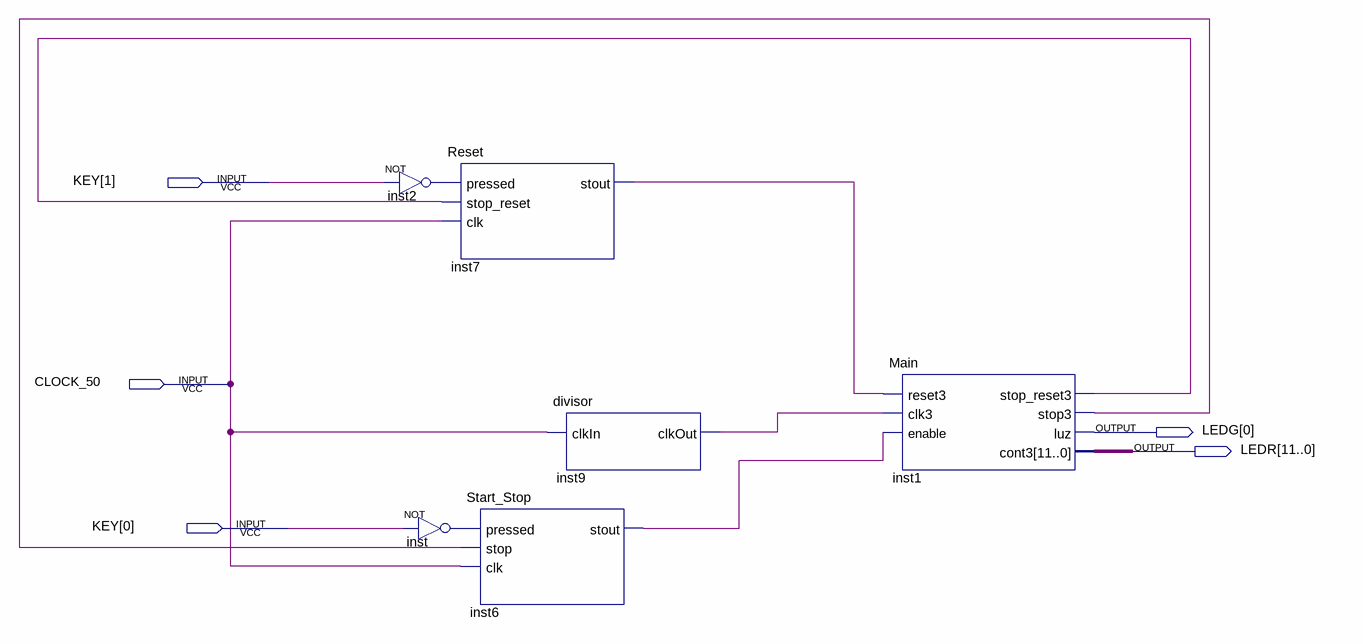
[diagram p0: schematic sheet]
// Quartus schematic Blocks.bdf as structural Verilog: 6 symbols, 5 pins
module Blocks (
  input  [1:0] KEY,
  input  CLOCK_50,
  output [0:0] LEDG,
  output [11:0] LEDR
);

  wire inst1_stop3, inst1_stop_reset3, inst2_out, inst6_stout, inst7_stout, inst9_clkout, inst_out;

  Reset inst7 (.pressed(inst2_out), .stop_reset(inst1_stop_reset3), .clk(CLOCK_50), .stout(inst7_stout));
  not inst2 (inst2_out, KEY[1]);
  not inst (inst_out, KEY[0]);
  Start_Stop inst6 (.pressed(inst_out), .stop(inst1_stop3), .clk(CLOCK_50), .stout(inst6_stout));
  divisor inst9 (.clkIn(CLOCK_50), .clkOut(inst9_clkout));
  Main inst1 (
    .reset3(inst7_stout), .clk3(inst9_clkout), .enable(inst6_stout), .stop_reset3(inst1_stop_reset3),
    .stop3(inst1_stop3), .luz(LEDG[0]), .cont3(LEDR));
endmodule
